# Altium schematic sheet bg_sensor.SchDoc
size A3
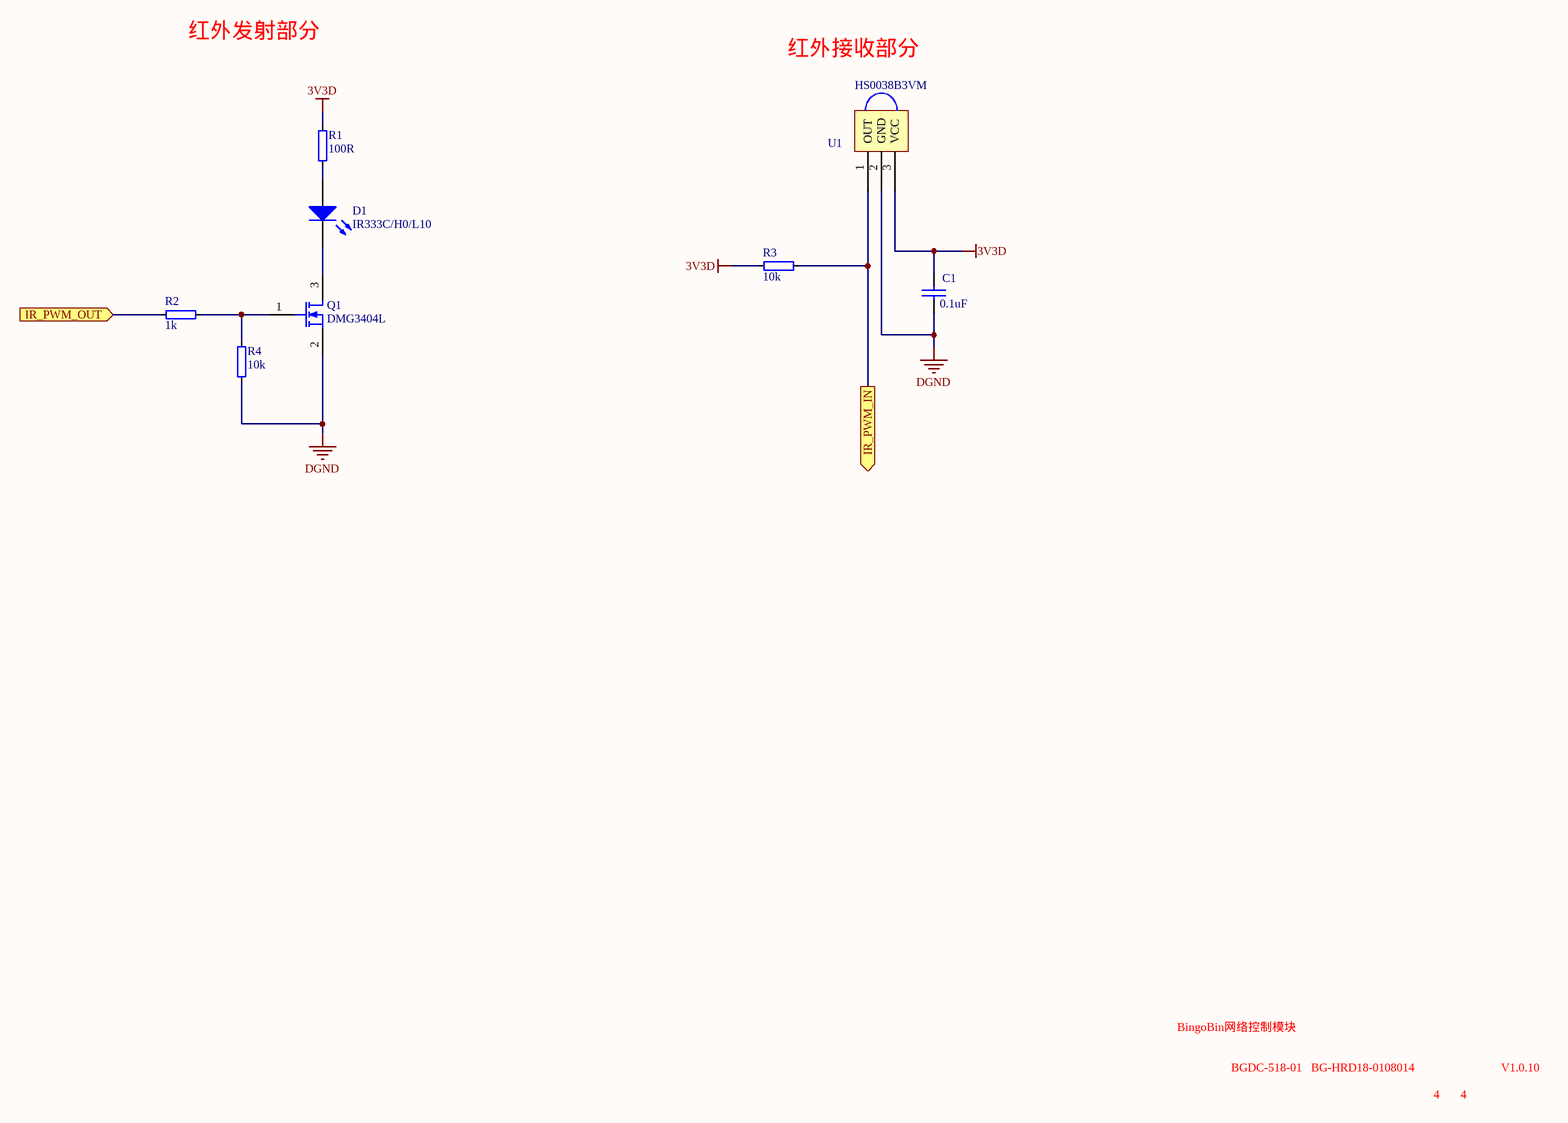
[diagram p0: bg_sensor.SchDoc]

## Parts
C1  0.1uF  [C0603]
D1  IR333C/H0/L10  [LED]
Q1  DMG3404L  [sot-23]
R1  100R  [R0603]
R2  1k  [R0603]
R3  10k  [R0603]
R4  10k  [R0603]
U1  HS0038B3VM  [DIP_3]

## Ports
IR_PWM_IN (out), IR_PWM_OUT (in)

## Nets
3V3D: C1.2 R1.2 R3.2 U1.3(VCC)
DGND: C1.1 Q1.2(S) R4.1 U1.2(GND)
IR_PWM_IN: R3.1 U1.1(OUT) ; port IR_PWM_IN
IR_PWM_OUT: R2.1 ; port IR_PWM_OUT
NetD1_1: D1.1(A) R1.1
NetD1_2: D1.2(K) Q1.3(D)
NetQ1_1: Q1.1(G) R2.2 R4.2

## Notes on the sheet
- 红外发射部分
- 红外接收部分
- BingoBin网络控制模块
- BGDC-518-01   BG-HRD18-0108014
- 4
- V1.0.10

## Library data of the parts
C1 = C0603: Capacitor, Ceramic, 0.1uF, 16V, 10%, 0603, X7R; Manufacturer: muRata; Value: 0.1uF; Manufacturer Part Number: *
D1 = LED1: Typical RED GaAs LED; Manufacturer: EVERLIGHT; Value: IR333C/H0/L10; data_net: http://www.szlcsc.com/product/pdf/A_CE940DB3AD015B83.PDF; Manufacturer Part Number: IR333C/H0/L10
Q1 = MOSFET-N: N沟道,30V,5.6A,27mΩ(Typ,@Vgs=4.5V); Manufacturer: DIODES; Published: 8-Jun-2000; LatestRevisionDate: 17-Jul-2002; LatestRevisionNote: Re-released for DXP Platform.; PackageVersion: 1995/1996; PackageReference: E3; Publisher: Altium Limited; PackageDescription: TO, Flat Index; 3 In-Line, Axial Leads; Body Dia. 4.6mm; Lead Dia. 0.5 mm (max); Manufacturer Part Number: DMG3404L; Value: DMG3404L
R1-R4 = R0402-12k: RES, THICK FILM, 10K, 5%, 1/10W, 0603; Part Number: R0402-10k; Manufacturer: muRata; Note: Chip Res 1%; Artikkelnr Noca: 27049099; Manufacturer Part Number: *; Datasheet: *; Footprint: 0402; LatestRevisionDate: 2009-11-23; Pin Count: 2; Publisher: Nordic Semiconductor; Published: 2009-05-08; Supplier: Farnell; Supplier part number: 173-8865; 2nd source Supplier: *; 2nd source part number: *
  R1: Value: 100R
  R2: Value: 1k
  R3 R4: Value: 10k
U1 = 1838: Manufacturer: Vishay; Value: HS0038B3VM; Manufacturer Part Number: HS0038B3VM